# Altium schematic sheet SD_USB_FMU3_REV_G.SchDoc: Pixhawk_mini_8L.sch
size A4; Date: 18/08/2014 1:53:11 PM; DrawnBy: Philip Rowse; SheetNumber: 2; SheetTotal: 10
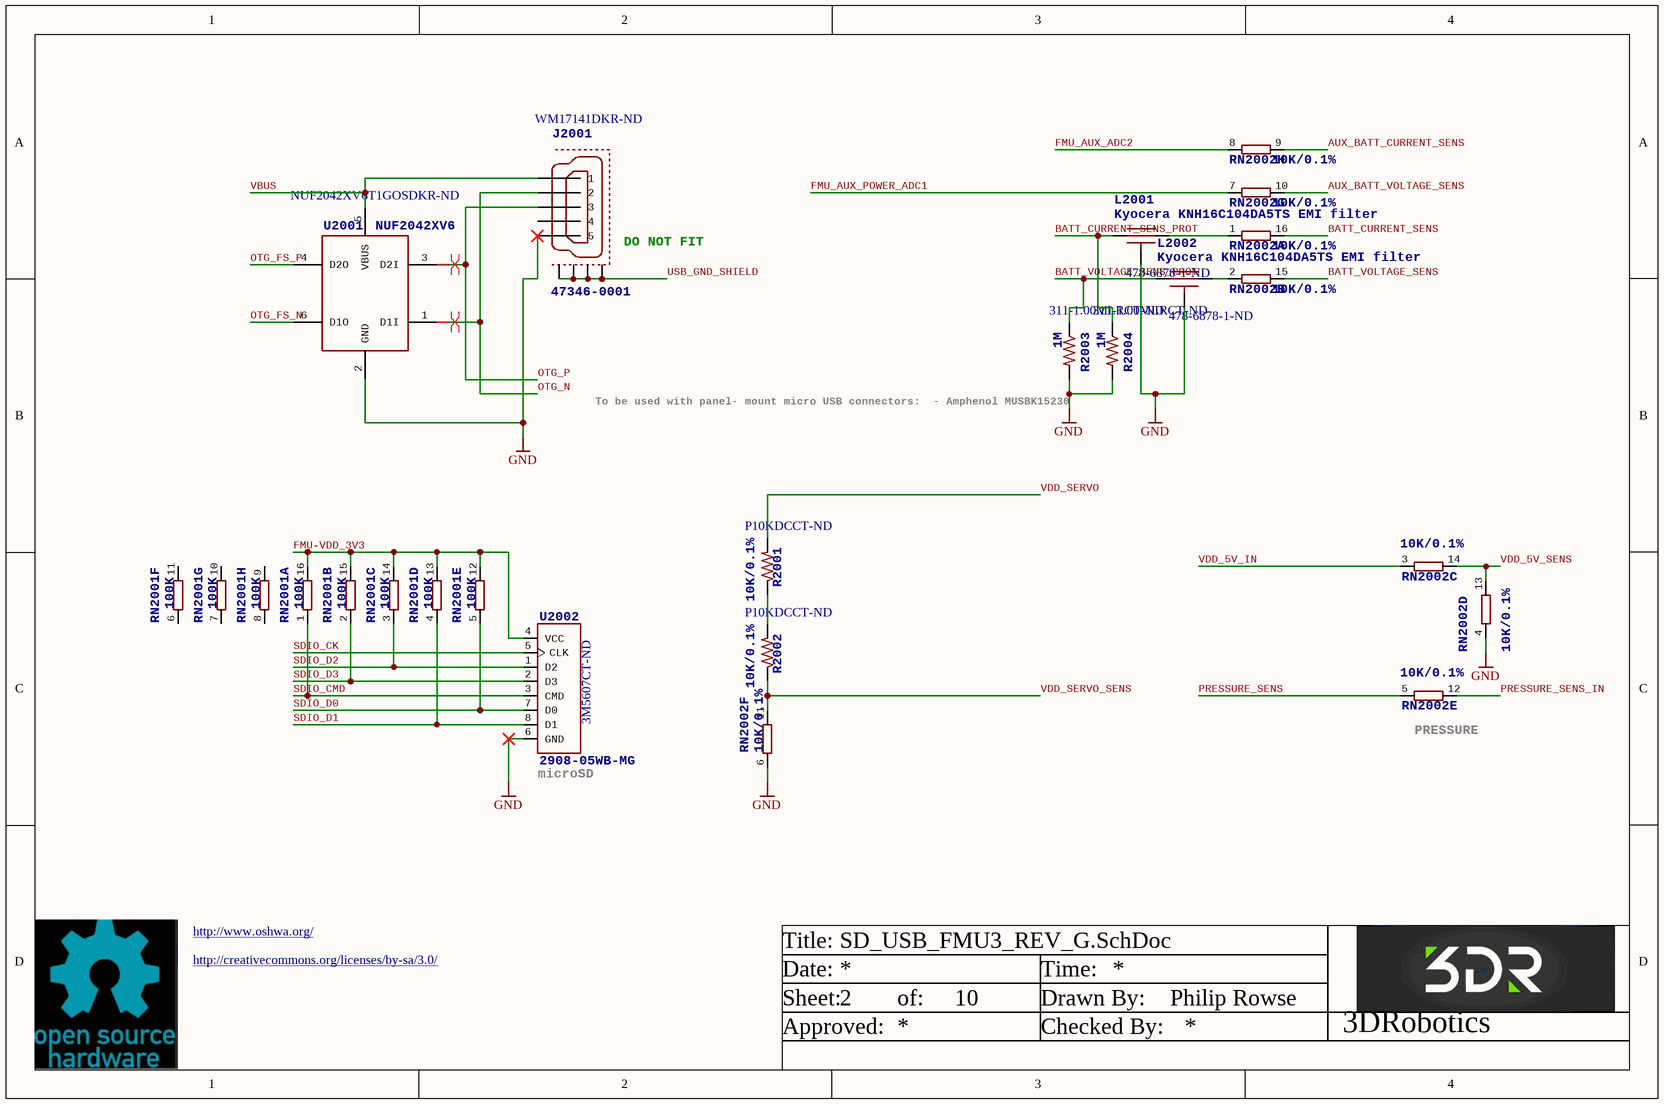
[diagram p0: SD_USB_FMU3_REV_G.SchDoc]

## Parts
J2001  47346-0001  Supplier Part Number 1: WM17141DKR-ND  [MOLEX-47346-0001]
L2001  Kyocera KNH16C104DA5TS EMI filter  Supplier Part Number 1: 478-6878-1-ND  [KYOCERA-KNH16-DA]
L2002  Kyocera KNH16C104DA5TS EMI filter  Supplier Part Number 1: 478-6878-1-ND  [KYOCERA-KNH16-DA]
R2001  10K/0.1%  Supplier Part Number 1: P10KDCCT-ND  [0402-RES]
R2002  10K/0.1%  Supplier Part Number 1: P10KDCCT-ND  [0402-RES]
R2003  1M  Supplier Part Number 1: 311-1.00MLRCT-ND  [0402-RES]
R2004  1M  Supplier Part Number 1: 311-1.00MLRCT-ND  [0402-RES]
RN2001  100K  [EXB2HV]  (parts A,B,C,D,E,F,G,H of 8)
RN2002  10K/0.1%  [EXB2HV]  (parts A,B,C,D,E,F,G,H of 8)
U2001  NUF2042XV6  Supplier Part Number 1: NUF2042XV6T1GOSDKR-ND  [SOT563-6]
U2002  2908-05WB-MG  Supplier Part Number 1: 3M5607CT-ND  [MICROSD]

## Nets
GND: J2001.GND(5) L2001.GND L2002.GND R2003.P$2 R2004.P$2 RN2002.4 RN2002.6 U2001.2(GND) U2002.6(GND)
AUX_BATT_CURRENT_SENS: RN2002.9
AUX_BATT_VOLTAGE_SENS: RN2002.10
BATT_CURRENT_SENS: RN2002.16
BATT_CURRENT_SENS_PROT: L2001.P$1 R2004.P$1
BATT_VOLTAGE_SENS: RN2002.15
BATT_VOLTAGE_SENS_PROT: L2002.P$1 R2003.P$1
FMU-VDD_3V3: RN2001.12 RN2001.13 RN2001.14 RN2001.15 RN2001.16 U2002.4(VCC)
FMU_AUX_ADC2: RN2002.8
FMU_AUX_POWER_ADC1: RN2002.7
OTG_FS_N: U2001.6(D1O)
OTG_FS_P: U2001.4(D2O)
OTG_N: J2001.D-(2) U2001.1(D1I)
OTG_P: J2001.D+(3) U2001.3(D2I)
PRESSURE_SENS: RN2002.5
PRESSURE_SENS_IN: RN2002.12
SDIO_CK: U2002.5(CLK)
SDIO_CMD: RN2001.1 U2002.3(CMD)
SDIO_D0: RN2001.5 U2002.7(D0)
SDIO_D1: RN2001.4 U2002.8(D1)
SDIO_D2: RN2001.3 U2002.1(D2)
SDIO_D3: RN2001.2 U2002.2(D3)
USB_GND_SHIELD: J2001.GND1 J2001.GND2 J2001.GND3 J2001.GND4
VBUS: J2001.VBUS(1) U2001.5(VBUS)
VDD_5V_IN: RN2002.3
VDD_5V_SENS: RN2002.13 RN2002.14
VDD_SERVO: R2001.P$2
VDD_SERVO_SENS: R2002.P$1 RN2002.11
NetL2001_P$2: L2001.P$2 RN2002.1
NetL2002_P$2: L2002.P$2 RN2002.2
NetR2001_P$1: R2001.P$1 R2002.P$2

Not connected (* = marked no-connect by the designer): J2001 ID(4); RN2001 6(1) 7(1) 8(1) 9(2) 10(2) 11(2)

## Layout directives
differential pair: OTG_N, OTG_P

## Notes on the sheet
- (near J2001) DO NOT FIT
- To be used with panel-
  mount micro USB connectors:
  - Amphenol MUSBK15230
- (near RN2002) PRESSURE
- (near U2002) microSD
- http://www.oshwa.org/
- http://creativecommons.org/licenses/by-sa/3.0/
- Title:
- Date:
- Time:
- Sheet:
- Approved:
- of:
- Drawn By:
- Checked By:
- 3DRobotics

## Library data of the parts
J2001 = MOLEX-47346-0001: MICRO USB B, BOTTOM MOUNT; 3DR_PARTNO: ECM0486; PARTNO: 0473460001; Supplier 1: Digi-Key
L2001 L2002 = KNH16C104DA5TS: FILTER CAP 0.1UF 2A 25V 0603; 3DR_PARTNO: ECM0719; Value: 0u1; Supplier 1: Digi-Key; PARTNO: KNH16C104DA5TS
R2001 R2002 = RESISTOR0402-RES: RES 10K OHM 1/16W .1% 0402 SMD; 3DR_PARTNO: ECM0810; PARTNO: ERA-2AEB103X; Supplier 1: Digi-Key; Value: 10K
R2003 R2004 = RESISTOR0402-RES: RES 1M OHM 1/16W 1% 0402 SMD; PARTNO: RC0402FR-071ML; 3DR_PARTNO: ECM0806; Supplier 1: Digi-Key; Value: 1M
RN2001 = 8R-NEXB2HV-100K: RES ARRAY 100K OHM 8 RES 1506; PARTNO: EXB-2HV104JV; 3DR_PARTNO: ECM0101; OC_FARNELL: unknown; OC_NEWARK: unknown; Supplier 1: Digi-Key; Supplier Part Number 1: Y1104CT-ND; Value: 100K
RN2002 = 8R-NEXB2HV-10K: RES ARRAY 10K OHM 8 RES 1506; PARTNO: EXB-2HV103JV; 3DR_PARTNO: ECM0546; OC_FARNELL: unknown; OC_NEWARK: unknown; Supplier 1: Digi-Key; Supplier Part Number 1: Y1103CT-ND; Value: 10K
U2001 = NUF2042XV6: IC FILTER USB ESD PROTECT SOT363; PARTNO: NUF2042XV6T1G; 3DR_PARTNO: ECM0836; Supplier 1: Digi-Key
U2002 = MICROSDSDI: CONN MICRO SD CARD PUSH-PUSH R/A; 3DR_PARTNO: ECM0485; PARTNO: 2908-05WB-MG; Supplier 1: Digi-Key